# Altium schematic sheet Power.SchDoc
size A
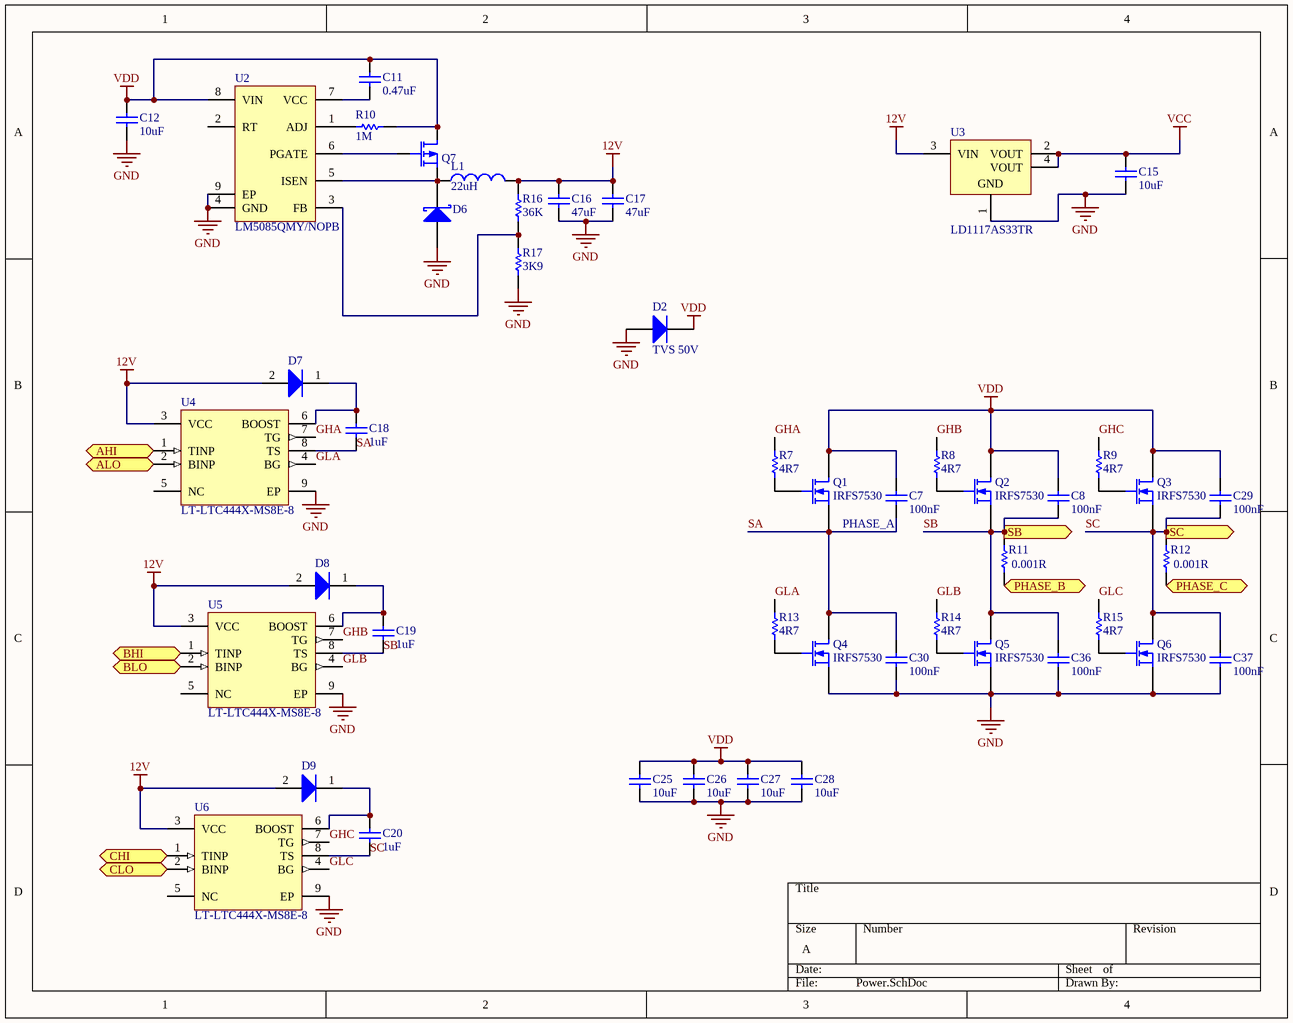
[diagram p0: Power.SchDoc]

## Parts
C7  100nF  [CAPC0603(1608)100_L]
C8  100nF  [CAPC0603(1608)100_L]
C11  0.47uF  [CAPC0603(1608)100_N]
C12  10uF  [CAPC1206(3216)190_M]
C15  10uF  [CAPC0603(1608)100_M]
C16  47uF  [CAPC1210(3225)280_N]
C17  47uF  [CAPC1210(3225)280_N]
C18  1uF  [CAPC0603(1608)100_N]
C19  1uF  [CAPC0603(1608)100_N]
C20  1uF  [CAPC0603(1608)100_N]
C25  10uF  [CAPC1206(3216)190_M]
C26  10uF  [CAPC1206(3216)190_M]
C27  10uF  [CAPC1206(3216)190_M]
C28  10uF  [CAPC1206(3216)190_M]
C29  100nF  [CAPC0603(1608)100_L]
C30  100nF  [CAPC0603(1608)100_L]
C36  100nF  [CAPC0603(1608)100_L]
C37  100nF  [CAPC0603(1608)100_L]
D2  TVS 50V  [VISH-DO-214AC-2_N]
D6  (no value)  [SMB]
D7  (no value)  [ONSC-SOD-323-2-477-02_V]
D8  (no value)  [ONSC-SOD-323-2-477-02_V]
D9  (no value)  [ONSC-SOD-323-2-477-02_V]
L1  value 22uH  [SDR0805-180ML]  (hidden comment: SDR0805-180ML)
Q1  IRFS7530  [DPAK127P1525X483-7N]
Q2  IRFS7530  [DPAK127P1525X483-7N]
Q3  IRFS7530  [DPAK127P1525X483-7N]
Q4  IRFS7530  [DPAK127P1525X483-7N]
Q5  IRFS7530  [DPAK127P1525X483-7N]
Q6  IRFS7530  [DPAK127P1525X483-7N]
Q7  MOSFET-P  [SOIC127P600X175-8N]  (value not drawn)
R7  4R7  [RESC0603(1608)_N]
R8  4R7  [RESC0603(1608)_N]
R9  4R7  [RESC0603(1608)_N]
R10  1M  [RESC0603(1608)_N]
R11  value 0.001R  [Shunt]
R12  value 0.001R  [Shunt]
R13  4R7  [RESC0603(1608)_N]
R14  4R7  [RESC0603(1608)_N]
R15  4R7  [RESC0603(1608)_N]
R16  36K  [RESC0603(1608)_L]
R17  3K9  [RESC0603(1608)_N]
U2  LM5085QMY/NOPB  [MUY08A_N]
U3  LD1117AS33TR  [SOT-223_M]
U4  LT-LTC444X-MS8E-8  [LT-MS8E-8-EDP_L]
U5  LT-LTC444X-MS8E-8  [LT-MS8E-8-EDP_L]
U6  LT-LTC444X-MS8E-8  [LT-MS8E-8-EDP_L]

## Ports
AHI (in), ALO (in), BHI (in), BLO (in), CHI (in), CLO (in), PHASE_B (out), PHASE_C (out), SB (out), SC (out)

## Nets
12V: C16.2 C17.2 D7.2(A) D8.2(A) D9.2(A) L1.2 R16.2 U3.3(VIN) U4.3(VCC) U5.3(VCC) U6.3(VCC)
GND: C12.1 C15.1 C16.1 C17.1 C25.1 C26.1 C27.1 C28.1 C30.1 C36.1 C37.1 D2.2(A) D6.1(A) Q4.3(S) Q5.3(S) Q6.3(S) R17.1 U2.4(GND) U2.9(EP) U3.1(GND) U4.9(EP) U5.9(EP) U6.9(EP)
VCC: C15.2 U3.2(VOUT) U3.4(VOUT)
VDD: C7.2 C8.2 C11.2 C12.2 C25.2 C26.2 C27.2 C28.2 C29.2 D2.1(K) Q1.1(D) Q2.1(D) Q3.1(D) Q7.2(D) R10.2 U2.8(VIN)
AHI: U4.1(TINP) ; port AHI
ALO: U4.2(BINP) ; port ALO
BHI: U5.1(TINP) ; port BHI
BLO: U5.2(BINP) ; port BLO
CHI: U6.1(TINP) ; port CHI
CLO: U6.2(BINP) ; port CLO
GHA: R7.2 U4.7(TG)
GHB: R8.2 U5.7(TG)
GHC: R9.2 U6.7(TG)
GLA: R13.2 U4.4(BG)
GLB: R14.2 U5.4(BG)
GLC: R15.2 U6.4(BG)
PHASE_B: R11.1 ; port PHASE_B
PHASE_C: R12.1 ; port PHASE_C
SA: C7.1 C18.1 C30.2 Q1.3(S) Q4.1(D) U4.8(TS)
SB: C8.1 C19.1 C36.2 Q2.3(S) Q5.1(D) R11.2 U5.8(TS) ; port SB
SC: C20.1 C29.1 C37.2 Q3.3(S) Q6.1(D) R12.2 U6.8(TS) ; port SC
NetC11_1: C11.1 U2.7(VCC)
NetC18_2: C18.2 D7.1(K) U4.6(BOOST)
NetC19_2: C19.2 D8.1(K) U5.6(BOOST)
NetC20_2: C20.2 D9.1(K) U6.6(BOOST)
NetD6_2: D6.2(K) L1.1 Q7.3(S) U2.5(ISEN)
NetQ1_2: Q1.2(G) R7.1
NetQ2_2: Q2.2(G) R8.1
NetQ3_2: Q3.2(G) R9.1
NetQ4_2: Q4.2(G) R13.1
NetQ5_2: Q5.2(G) R14.1
NetQ6_2: Q6.2(G) R15.1
NetQ7_1: Q7.1(G) U2.6(PGATE)
NetR10_1: R10.1 U2.1(ADJ)
NetR16_1: R16.1 R17.2 U2.3(FB)

Not connected (* = marked no-connect by the designer): U2 2(RT); U4 5(NC); U5 5(NC); U6 5(NC)

## Notes on the sheet
- PHASE_A

## Library data of the parts
C7 C8 C29 C30 C36 C37 = CMP-1035-02591-1: CAP 100nF 50V ±5% 0603 (1608 Metric) Thickness 1mm SMD; Tolerance: Â±5%; Case-Metric: 1608; Case-EIA: 0603; Rated Voltage: 50 V; Max Thickness: 1 mm; Technology: SMT; Value: 100nF
C11 = CMP-1035-02708-1: CAP 470nF 50V ±10% 0603 (1608 Metric) Thickness 1mm SMD; Case-EIA: 0603; Case-Metric: 1608; Tolerance: Â±10%; Rated Voltage: 50 V; Value: 470nF; Max Thickness: 1 mm; Technology: SMT
C12 C25-C28 = CMP-1037-04982-1: CAP 10uF 50V Â±10% 1206 (3216 Metric) Thickness 1.9mm SMD; Case-EIA: 1206; Case-Metric: 3216; Technology: SMT; Tolerance: Â±10%; Max Thickness: 1.9 mm; Value: 10uF; Rated Voltage: 50 V
C15 = CMP-1035-02796-1: CAP 10uF 6.3V ±10% 0603 (1608 Metric) Thickness 1mm SMD; Case-EIA: 0603; Tolerance: Â±10%; Case-Metric: 1608; Value: 10uF; Technology: SMT; Rated Voltage: 6.3 V; Max Thickness: 1 mm
C16 C17 = CMP-1038-02295-1: CAP 47uF 16V ±10% 1210 (3225 Metric) Thickness 2.8mm SMD; Case-EIA: 1210; Case-Metric: 3225; Tolerance: Â±10%; Value: 47uF; Rated Voltage: 16 V; Max Thickness: 2.8 mm; Technology: SMT
C18-C20 = CMP-1035-02736-1: CAP 1uF 16V ±5% 0603 (1608 Metric) Thickness 1mm SMD; Case-Metric: 1608; Case-EIA: 0603; Tolerance: Â±5%; Technology: SMT; Max Thickness: 1 mm; Rated Voltage: 16 V; Value: 1uF
D2 = CMP-0548-00253-1: Transient Voltage Suppressor, 6.40 to 231 V, 45 V Stand-off Voltage, Uni-Directional, -55 to 155 degC, 2-pin DO-214AC, Pb-Free, Tape and Reel; PartNumber: SMAJ45A-E3/61; Manufacturer: Vishay Semiconductor; IFSM: 40 A; VWM (V): 45; VBR Uni-Directional (V): 6.4 to 231; ID (uA): 1; PPPM (W): 400, 300; ComponentLink2Description: Datasheet; PackageReference: DO-214AC-2; ComponentLink3URL: http://www.vishay.com/docs/88390/smaj50a.pdf; DatasheetVersion: 12/8/2013; RoHS: TRUE; ComponentLink2URL: http://www.vishay.com/docs/88390/smaj50a.pdf; ComponentLink1Description: Manufacturer URL; PackageDescription: 2-Pin DO-214AC (SMA), Body 4.245 x 2.665 mm; Mounting Technology: Surface Mount; Packing: Tape and Reel; ComponentLink3Description: Package Specification; ComponentLink1URL: http://www.vishay.com/; Operating Junction and Storage Temperature Range: -55 to 150 degC
D6 = D Schottky: Schottky Diode; Published: 8-Jun-2000; LatestRevisionDate: 17-Jul-2002; LatestRevisionNote: Re-released for DXP Platform.; PackageReference: SMB; Publisher: Altium Limited; PackageDescription: DO-214-AA/SMB; 2 C-Bend Leads; Body 5.3 x 3.6 mm, inc. leads (LxW); Code_JEDEC: DO-214-AA
D7-D9 = CMP-1051-00017-1: Silicon Hot-Carrier Diode, Schottky Barrier Diode, 2-Pin SOD-323, Pb-Free, Tape and Reel; PartNumber: MMDL301T1G; Manufacturer: On Semiconductor; Configuration: Single; Packing: Tape and Reel; ComponentLink2Description: Datasheet; PackageDescription: 2-Pin SOD, Body 1.7 x 1.25 mm; ComponentLink1URL: http://www.onsemi.com/; PackageReference: SOD-323-2-477-02; ComponentLink3URL: http://www.onsemi.com/pub_link/Collateral/477-02.PDF.1; ComponentLink1Description: Manufacturer URL; DatasheetVersion: Rev. 2; Mounting Technology: Surface Mount; ComponentLink2URL: http://www.onsemi.cn/pub_link/Collateral/MMDL301T1-D.PDF; PackageVersion: Rev. H, 03/2007; ComponentLink3Description: Package Specification; RoHS: TRUE
L1 = SDR0805-180ML: Inductor; Code_IEC: 1005; Published: 8-Jun-2000; LatestRevisionDate: 29-May-2009; LatestRevisionNote: IPC-7351 Footprint Added.; PackageReference: 0402-A; Publisher: Altium Limited; PackageDescription: Chip Inductor; Code_JEITA: 0402
Q1-Q6 = IRFS7530: N-Channel MOSFET; pin to pad: 1>8 2>1 3>2+3+5+6+7; Published: 8-Jun-2000; LatestRevisionDate: 17-Jul-2002; LatestRevisionNote: Re-released for DXP Platform.; PackageVersion: 1995/1996; PackageReference: E3; Publisher: Altium Limited; PackageDescription: TO, Flat Index; 3 In-Line, Axial Leads; Body Dia. 4.6mm; Lead Dia. 0.5 mm (max)
Q7 = MOSFET-P: P-Channel MOSFET; pin to pad: 1>2 2>3 3>1; Published: 8-Jun-2000; LatestRevisionDate: 17-Jul-2002; LatestRevisionNote: Re-released for DXP Platform.; PackageVersion: 1995/1996; PackageReference: E3; Publisher: Altium Limited; PackageDescription: TO, Flat Index; 3 In-Line, Axial Leads; Body Dia. 4.6mm; Lead Dia. 0.5 mm (max)
R7-R9 R13-R15 = CMP-1012-00018-1: 4R7 0.1W 5% 0603 (1608 Metric)  SMD; Value: 4.70 Ohm; Case-EIA: 0603; Case-Metric: 1608; Power: 0.1 W; Tolerance: 5 %; Technology: SMT
R10 = CMP-1012-00146-1: 1M 0.1W 5% 0603 (1608 Metric)  SMD; Case-EIA: 0603; Value: 1000000.00 Ohm; Case-Metric: 1608; Technology: SMT; Power: 0.1 W; Tolerance: 5 %
R11 = Shunt: 0.001R; Published: 8-Jun-2000; LatestRevisionDate: 17-Jul-2002; LatestRevisionNote: Re-released for DXP Platform.; PackageReference: AXIAL-0.3; Publisher: Altium Limited; PackageDescription: Axial Device, Thru-Hole; 2 Leads; 0.3 in Pin Spacing
R12 = Shunt: Resistor; Published: 8-Jun-2000; LatestRevisionDate: 17-Jul-2002; LatestRevisionNote: Re-released for DXP Platform.; PackageReference: AXIAL-0.3; Publisher: Altium Limited; PackageDescription: Axial Device, Thru-Hole; 2 Leads; 0.3 in Pin Spacing
R16 = CMP-1012-00111-1: 36K 0.1W 5% 0603 (1608 Metric)  SMD; Value: 36000.00 Ohm; Case-Metric: 1608; Case-EIA: 0603; Tolerance: 5 %; Technology: SMT; Power: 0.1 W
R17 = CMP-1012-00088-1: 3K9 0.1W 5% 0603 (1608 Metric)  SMD; Case-EIA: 0603; Value: 3900.00 Ohm; Case-Metric: 1608; Power: 0.1 W; Technology: SMT; Tolerance: 5 %
U2 = CMP-0069-01314-2: 75V Constant On-Time PFET Buck Switching Controller, 8-pin eMSOP, Pb-Free; Manufacturer: National Semiconductor; CompType: Switcher; PackageTopMarking: ZXTT*SYCB; PowerWise: Y; ComponentLink3Description: MUY08A Package Page; ComponentLink1URL: http://www.national.com/ds/LM/LM5085.pdf; PackageReference: MUY08A; RevisionNote: Component URLs added; ComponentLink3URL: http://www.national.com/packaging/folders/muy08a.html; DatasheetVersion: Dec-2009; ComponentLink1Description: LM5085 Datasheet; ComponentLink2URL: http://www.national.com/pf/LM/LM5085.html; RoHS: Y; PackageVersion: revA, Nov-2003; Code_JEDEC: MO-187-AA; PackageDescription: Molded Mini-SO, Exposed Pad, .118 x .118 x .034in Body, 8 Lead, .0256in Pitch; ComponentLink2Description: LM5085 Web Page; PinCount: 8
U3 = CMP-0244-00316-1: 1A, Low Drop Positive Voltage Regulator, 3.3V, 4-Pin SOT-223, Tape and Reel; ComponentLink1Description: Manufacturer URL; DatasheetVersion: 2/12/2011; PackageVersion: 2010; ComponentLink1URL: http://www.st.com; ComponentLink2Description: Datasheet; ComponentLink2URL: http://www.st.com/internet/com/TECHNICAL_RESOURCES/TECHNICAL_LITERATURE/DATASHEET/CD00002116.pdf; PackageDescription: 4-Pin SOT-223 Package, 6.5 x 3.5 mm Body, 2.3 mm Pitch, 7 mm Lead Span; PackageReference: SOT-223